# EAGLE design ENCODER_V2 (EAGLE 9.5.1)
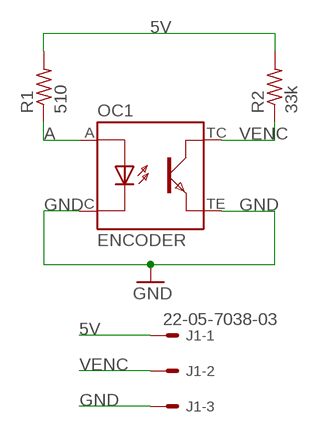
[diagram p0: schematic, sheet 1]

## Parts
J1  22-05-7038-03  [7395-03]
OC1  ENCODER  PC-GP1S53V  [PI_GP1S53VJ000F]
R1  510  R-US_R0805  [R0805]
R2  33k  R-US_R0805  [R0805]

## Nets
5V: J1.1 R1.2 R2.2
A: OC1.A R1.1
GND: J1.3 OC1.C OC1.TE
VENC: J1.2 OC1.TC R2.1

## Library data of the parts
J1 = con-molex:22-?-03: CONNECTOR wire to board 2.54 mm (.1 inch) pitch header; MF: MOLEX; OC_FARNELL: unknown; OC_NEWARK: unknown
OC1 = we-opto:PC: Photocoupler / Photointerrupter TLP127 compatible with TLP187 and LTV-352T
R1 R2 = rcl:R-US_: RESISTOR, American symbol; SPICEPREFIX: R

## Board
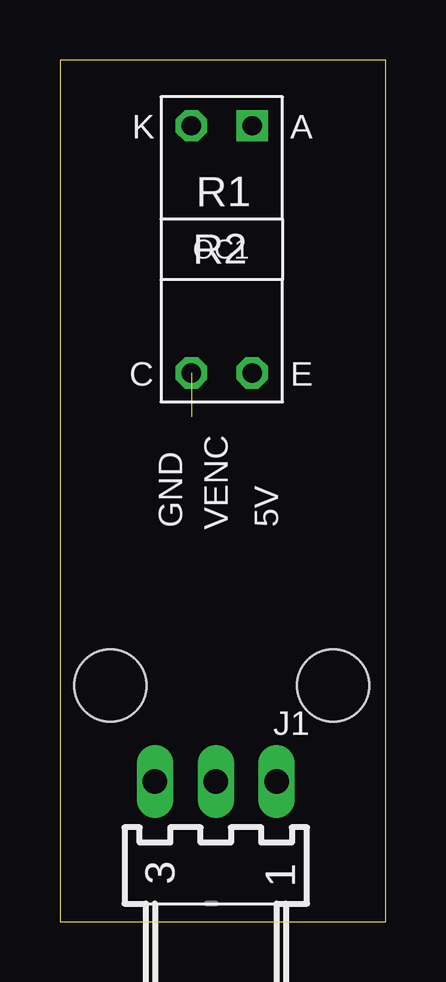
[diagram p1: board, top side]
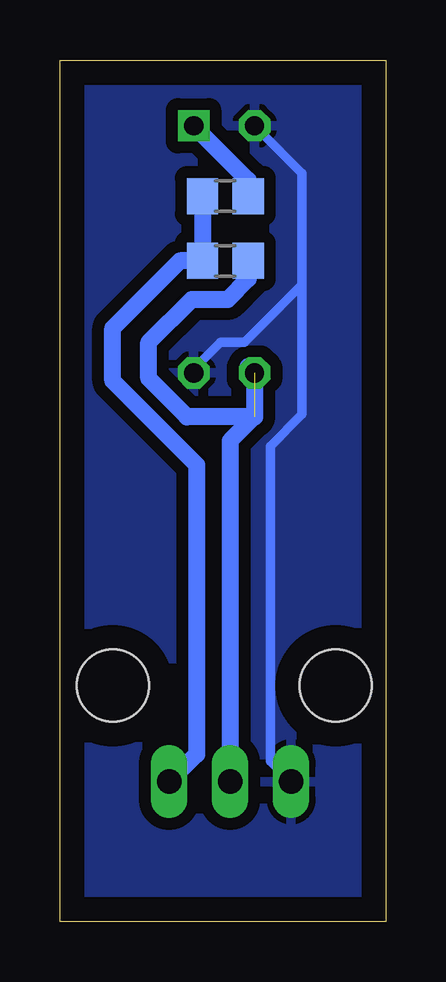
[diagram p2: board, bottom side, seen from below]

Size 13.6 x 35.9 mm. Coordinates in mm from the lower left corner, seen from the top.
Outline: 0,0 13.6,0 13.6,35.9 0,35.9 0,0
Copper layers (1*16): Top 0.035mm / dielectric 1.5mm / Bottom 0.035mm
Design rules "default": minimum track width 6mil, minimum drill 0.35mm, track to track 6mil, track to pad 6mil, pad to pad 6mil, via to via 6mil, smd to smd 6mil, copper to edge 40mil, drill to drill 6mil, minimum pad ring 10mil, minimum via ring 8mil, stop-mask expansion 4mil, vias tented up to drill 0mil, thermal gap 10mil
Holes 3 mm at 2.1,9.83 11.4,9.83

### Footprints (pad centres in the part's own frame; a part is rotated, then mirrored left to right if it is on the bottom)
7395-03 = drill 1.016 long: 1 2.54,0; 2 0,0; 3 -2.54,0
PI_GP1S53VJ000F = drill 0.8 square: A 1.27,5.15 | drill 0.8 octagon: C -1.27,5.15; TC -1.27,-5.15; TE 1.27,-5.15
R0805 = smd 1.3 x 1.5: 1 -0.95,0; 2 0.95,0

### Placement (x,y rotation side)
J1  6.5,5.83 0 top
OC1  6.75,28.01 0 top
R1  6.7,30.23 180 bottom
R2  6.7,27.53 180 bottom

### Tracks (layer width: path | path; a pad name or v marks a point on that pad's centre or on a via)
5V
  Bottom 0.7: R1.2 R2.2 8.6,27.53 11.4,24.73 11.4,22.53 7.9,19.03 7.9,6.97 J1.1
A
  Bottom 0.7: 5.8,30.18 R1.1 5.75,30.89 OC1.A
GND
  Bottom 0.4: OC1.C 3.5,31.18 3.5,26.53 | 3.5,26.53 5.9,24.13 6.9,24.13 8.02,23.01 OC1.TE | J1.3 4.82,6.69 4.82,19.81 3.5,21.13 3.5,26.53
  pour Bottom (isolate 0.5): -1,36.53 14.7,36.53 14.7,-1.97 -1,-1.97
VENC  (1 unrouted)
  Bottom 0.7: 5.75,23.13 OC1.TC 5.48,21.05 6.5,20.03 J1.2 | 5.48,21.03 8.3,21.03 9.9,22.63 9.9,24.13 8.1,25.93 6.6,25.93 5.75,26.78 R2.1

### Text on the board
tPlace: K | A | C | E | GND | 5V | VENC